# Altium project MiCom.PrjPcb (part 3 of 6)

## Sheet CAN.SchDoc
size A4
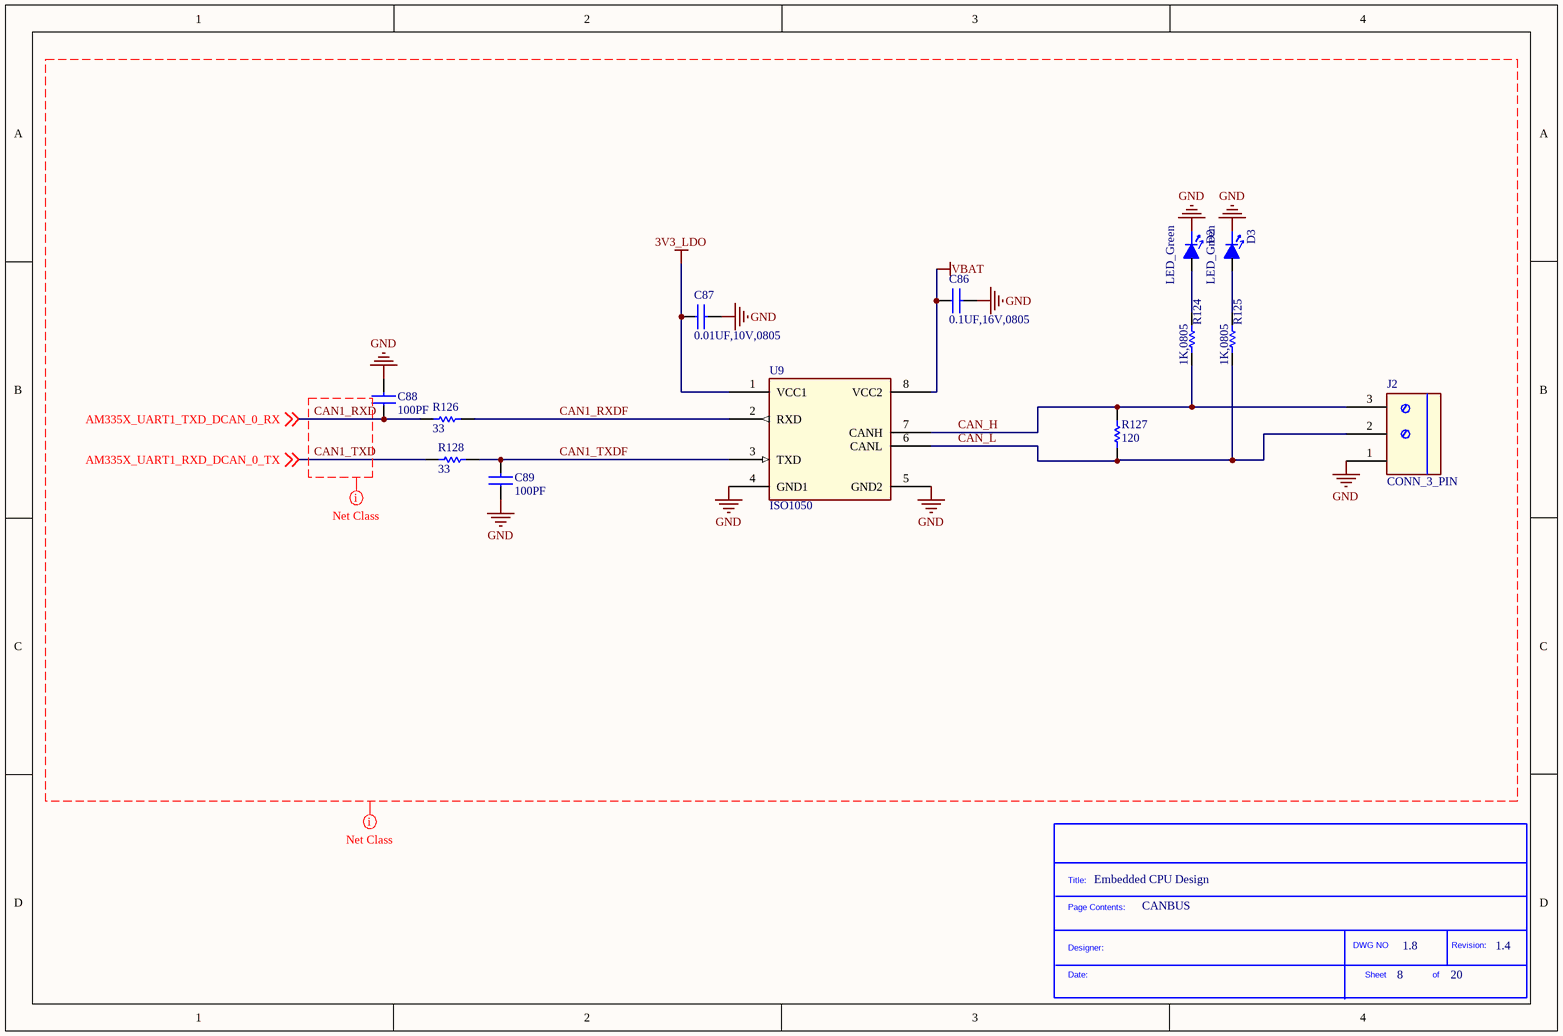
[diagram p8: CAN.SchDoc]

### Parts
(Parts that share a designator on the sheet are numbered #1, #2 ... from top to bottom, then left to right.)
*?#5  SDTitleBlock  (value not drawn)  (graphical)
C86  0.1UF,16V,0805  [0805]
C87  0.01UF,10V,0805  [0805]
C88  100PF  [0805]
C89  100PF  [0805]
D2  LED_Green  [LED_0805]
D3  LED_Green  [LED_0805]
J2  CONN_3_PIN  [CON_3]
R124  1K,0805  [0805]
R125  1K,0805  [0805]
R126  33  [0402]
R127  120  [0805]
R128  33  [0402]
U9  ISO1050  [so8_w_dub]

### Nets
3V3_LDO: C87.1 U9.1(VCC1)
GND: C86.2 C87.2 C88.2 C89.1 D2.1(Cathode) D3.1(Cathode) J2.1 U9.4(GND1) U9.5(GND2)
VBAT: C86.1 U9.8(VCC2)
CAN1_RXD: C88.1 R126.1 ; off-sheet AM335X_UART1_TXD_DCAN_0_RX  [also labelled AM335X_UART1_TXD_DCAN_0_RX]
CAN1_RXDF: R126.2 U9.2(RXD)
CAN1_TXD: R128.1 ; off-sheet AM335X_UART1_RXD_DCAN_0_TX  [also labelled AM335X_UART1_RXD_DCAN_0_TX]
CAN1_TXDF: C89.2 R128.2 U9.3(TXD)
CAN_H: J2.3 R124.1 R127.2 U9.7(CANH)
CAN_L: J2.2 R125.1 R127.1 U9.6(CANL)
NetD2_2: D2.2(Anode) R124.2
NetD3_2: D3.2(Anode) R125.2

### Layout directives
net class CAN: 3V3_LDO, AM335X_UART1_RXD_DCAN_0_TX, AM335X_UART1_TXD_DCAN_0_RX, CAN1_RXD, CAN1_RXDF, CAN1_TXD, CAN1_TXDF, CAN_H, CAN_L, GND, VBAT

### Notes on the sheet
- Embedded CPU Design
- CANBUS
- 8
- 1.8
- 20
- 1.4
- (in symbol SDTitleBlock) Title:; Page Contents:; DWG NO; Revision:; Designer:; Date:; Sheet; of

### Library data of the parts
C86 = 0.1UF,16V,0805: AVX - 0805YC104KAT2A - CAP, MLCC, X7R, 100NF, 16V, 0805; Capacitance: 0.1; Capacitance Tolerance: ± 10%; Dielectric Characteristic: X7; Voltage Rating: 16; Ceramic Capacitor Case: 0805 [2012 Metric]; SVHC: No SVHC (16-Jun-2014); Capacitor Case Style: 0805 [2012 Metric]<!--FANDB--><div class="features-and-benefits-container"></div>; Tolerance: ±10%; Supplier 1: Digi-Key; Manufacturer: AVX; Manufacturer Part Number: 0805YC104KAT2A; RoHS: YES; Stock 1: 9101; Pricing 1: 1=0.29, 10=0.198, 100=0.1008, 250=0.0816, 500=0.072, 1000=0.0612 (USD); Product Range: -; Operating Temperature Min: -55; Operating Temperature Max: 125; Packaging: Cut Tape; MSL: MSL 1 - Unlimited; Capacitance Tolerance ±: ± 10%; ComponentLink1URL: http://www.farnell.com/datasheets/1679506.pdf; ComponentLink1Description: http://www.farnell.com/datasheets/1679506.pdf; Supplier Part Number 1: 478-7961-1-ND; Category: Capacitors; Voltage - Rated: 16V; Temperature Coefficient: X7R; Mounting Type: Surface Mount, MLCC; Operating Temperature: -55°C ~ 125°C; Applications: General Purpose; Ratings: -; Package / Case: 0805 (2012 Metric); Size / Dimension: 0.079" L x 0.049" W (2.00mm x 1.25mm); Height - Seated (Max): -; Thickness (Max): 0.037" (0.94mm); Lead Spacing: -; Features: -; Lead Style: -; ComponentLink2URL: http://www.avx.com/docs/Catalogs/cx7r.pdf; ComponentLink2Description: http://www.avx.com/docs/Catalogs/cx7r.pdf
C87 = 0.01UF,10V,0805: MULTICOMP - MCSH21B103K100CT - CAP, MLCC, X7R, 10NF, 10V, 0805; Capacitance: 10000pF; Tolerance: ±10%; Voltage - Rated: 16V; Supplier 1: Digi-Key; Manufacturer: MULTICOMP; Manufacturer Part Number: MCSH21B103K100CT; RoHS: YES; Stock 1: 21284; Pricing 1: 1=0.24, 10=0.2, 50=0.1126, 100=0.1, 250=0.075, 500=0.06626, 1000=0.05875 (USD); ComponentLink1URL: http://www.farnell.com/datasheets/1825494.pdf; ComponentLink1Description: http://www.farnell.com/datasheets/1825494.pdf; Supplier Part Number 1: 399-7995-1-ND; Category: Capacitors; Packaging: Cut Tape (CT); Temperature Coefficient: X7R; Mounting Type: Surface Mount, MLCC; Operating Temperature: -55°C ~ 125°C; Applications: General Purpose; Ratings: -; Package / Case: 0805 (2012 Metric); Size / Dimension: 0.079" L x 0.049" W (2.00mm x 1.25mm); Height - Seated (Max): -; Thickness (Max): 0.035" (0.88mm); Lead Spacing: -; Features: -; Lead Style: -; ComponentLink2URL: http://www.kemet.com/docfinder?Partnumber=C0805C103K4RACTU; ComponentLink2Description: http://www.kemet.com/docfinder?Partnumber=C0805C103K4RACTU
C88 C89 = 100PF: MULTICOMP - MCMT21N101F100CT - CAP, MLCC, C0G/NP0, 100PF, 10V, 0805; Product Range: MULTICOMP - MCCA Series; Capacitance: 100; Capacitance Tolerance: ± 1%; Voltage Rating: 10; Ceramic Capacitor Case: 0805 [2012 Metric]; Capacitor Terminals: SMD; Temperature Coefficient: ± 30; Tolerance: ±10%; Voltage - Rated: 25V; Supplier 1: Digi-Key; Manufacturer: MULTICOMP; Manufacturer Part Number: MCMT21N101F100CT; RoHS: YES; Stock 1: 10259; Pricing 1: 1=0.16, 10=0.111, 50=0.063, 100=0.0522, 250=0.0432, 500=0.0366, 1000=0.0303 (USD); Dielectric Characteristic: C0G / NP0; Operating Temperature Min: -55; Operating Temperature Max: 125; Packaging: Cut Tape; MSL: -; Capacitance Tolerance ±: ± 1%; Capacitor Case Style: 0805 [2012 Metric]; Operating Temperature Range: -55°C to +125; Series: MT; ComponentLink1URL: http://www.farnell.com/datasheets/876497.pdf; ComponentLink1Description: http://www.farnell.com/datasheets/876497.pdf; ComponentLink2URL: http://www.farnell.com/datasheets/1825496.pdf; ComponentLink2Description: http://www.farnell.com/datasheets/1825496.pdf; Supplier Part Number 1: 399-9150-1-ND; Category: Capacitors; Mounting Type: Surface Mount, MLCC; Operating Temperature: -55°C ~ 125°C; Applications: General Purpose; Ratings: -; Package / Case: 0805 (2012 Metric); Size / Dimension: 0.079" L x 0.049" W (2.00mm x 1.25mm); Height - Seated (Max): -; Thickness (Max): 0.035" (0.88mm); Lead Spacing: -; Features: -; Lead Style: -; ComponentLink3URL: http://www.kemet.com/docfinder?Partnumber=C0805C101K3GACTU; ComponentLink3Description: http://www.kemet.com/docfinder?Partnumber=C0805C101K3GACTU
D2 D3 = LED_Green: LED Green SMD 20mA 2V 0805; TIIntPartnumber: 1F0008; MfrNum: 598-8170-107F; Mfr: Dialight; PartName: LEDGreen2x1.5; Cost10K: 0.052; Cost100: 0.081; Vendor: Digikey; Wavelength - Dominant: 566nm; Millicandela Rating: 20mcd; Viewing Angle: 140°; Lens Type: Clear; Lens Style/Size: Rectangle with Flat Top, 1.4mm x 1.25mm; DescriptiveText: LED Green SMD 20mA 2V 0805; Descriptive_Text: LED Green SMD 20mA 2V 0805; Supplier 1: Digi-Key; Manufacturer: Dialight; Manufacturer Part Number: 598-8170-107F; RoHS: RoHS Compliant; Category: Optoelectronics; Stock 1: 91030; Pricing 1: 1=0.42, 10=0.31, 25=0.248, 100=0.1643, 250=0.1364, 500=0.0992, 1000=0.0775 (USD); Packaging: Cut Tape (CT); Color: Green; Wavelength - Peak: -; Voltage - Forward (Vf) (Typ): 2V; Current - Test: 20mA; Package / Case: 0805 (2012 Metric); Size / Dimension: 2.00mm L x 1.25mm W; Height: 0.70mm; Mounting Type: Surface Mount; Luminous Flux @ Current - Test: -; ComponentLink1URL: http://media.digikey.com/pdf/Data%20Sheets/Dialight%20PDFs/598_Series_0805_Pkg.pdf; ComponentLink1Description: http://media.digikey.com/pdf/Data%20Sheets/Dialight%20PDFs/598_Series_0805_Pkg.pdf; Supplier Part Number 1: 350-2044-1-ND
R124 R125 = 1K,0805: BOURNS - CR0805-FX-1001ELF - RESISTOR, 1K, 0.125W, 1%; Product Range: BOURNS - CR Series; Resistance: 1; Power Rating: 125; Resistor Case Style: 0805 [2012 Metric]; Resistor Element Material: Thick Film; Temperature Coefficient: ± 100; Voltage Rating: 150; SVHC: No SVHC (16-Jun-2014); Resistor Mounting: SMD<!--FANDB--><div class="features-and-benefits-container"></div>; Power (Watts): 0.125W, 1/8W; Manufacturer: BOURNS; Manufacturer Part Number: CR0805-FX-1001ELF; RoHS: YES; Resistance Tolerance: ± 1%; Packaging: Cut Tape; MSL: MSL 1 - Unlimited; ComponentLink1URL: http://www.farnell.com/datasheets/1845293.pdf; ComponentLink1Description: http://www.farnell.com/datasheets/1845293.pdf; Supplier 1: Digi-Key; Category: Resistors; Stock 1: 2060902; Pricing 1: 1=0.1, 50=0.0288, 100=0.0219, 250=0.01624, 500=0.012, 1000=0.008, 2500=0.00675 (USD); Resistance (Ohms): 1k; Tolerance: ±1%; Composition: Thick Film; Features: Automotive AEC-Q200; Operating Temperature: -55°C ~ 155°C; Package / Case: 0805 (2012 Metric); Supplier Device Package: 0805; Size / Dimension: 0.079" L x 0.049" W (2.00mm x 1.25mm); Height: 0.028" (0.70mm); Number of Terminations: 2; ComponentLink2URL: http://industrial.panasonic.com/www-cgi/jvcr13pz.cgi?E+PZ+3+AOA0002+ERJ6ENF1001V+7+WW; ComponentLink2Description: http://industrial.panasonic.com/www-cgi/jvcr13pz.cgi?E+PZ+3+AOA0002+ERJ6ENF1001V+7+WW; Supplier Part Number 1: P1.00KCCT-ND
R126 R128 = 33: MULTICOMP - MC0805S8F330JT5E - RESISTOR, THICK FILM, 33 OHM, 125mW, 1%; Power (Watts): 0.1W, 1/10W; Temperature Coefficient: ±100ppm/°C; Supplier 1: Digi-Key; Manufacturer: MULTICOMP; Manufacturer Part Number: MC0805S8F330JT5E; RoHS: YES; Stock 1: 1096583; Pricing 1: 1=0.1, 50=0.0196, 100=0.0149, 250=0.01104, 500=0.00816, 1000=0.00544, 5000=0.00383 (USD); ComponentLink1URL: http://www.newark.com/pdfs/datasheets/spc/TA-677.pdf; ComponentLink1Description: http://www.newark.com/pdfs/datasheets/spc/TA-677.pdf; Supplier Part Number 1: P33.0LCT-ND; Category: Resistors; Packaging: Cut Tape (CT); Resistance (Ohms): 33; Tolerance: ±1%; Composition: Thick Film; Features: Automotive AEC-Q200; Operating Temperature: -55°C ~ 155°C; Package / Case: 0402 (1005 Metric); Supplier Device Package: 0402; Size / Dimension: 0.039" L x 0.020" W (1.00mm x 0.50mm); Height: 0.016" (0.40mm); Number of Terminations: 2; ComponentLink2URL: http://industrial.panasonic.com/www-cgi/jvcr13pz.cgi?E+PZ+3+AOA0002+ERJ2RKF33R0X+7+WW; ComponentLink2Description: http://industrial.panasonic.com/www-cgi/jvcr13pz.cgi?E+PZ+3+AOA0002+ERJ2RKF33R0X+7+WW
R127 = 120: BOURNS - CR0805-FX-1200GLF - RESISTOR, 0805, 120R, 1%, 1/8W; Tolerance: ±5%; Power (Watts): 0.125W, 1/8W; Temperature Coefficient: ±200ppm/°C; Supplier 1: Digi-Key; Manufacturer: BOURNS; Manufacturer Part Number: CR0805-FX-1200GLF; RoHS: YES; Stock 1: 49631; Pricing 1: 1=0.1, 10=0.021, 50=0.0116, 100=0.0088, 250=0.00652, 500=0.0048, 1000=0.0032, 2500=0.0027 (USD); ComponentLink1URL: http://www.farnell.com/datasheets/1845293.pdf; ComponentLink1Description: http://www.farnell.com/datasheets/1845293.pdf; Supplier Part Number 1: RMCF0805JT120RCT-ND; Category: Resistors; Packaging: Cut Tape (CT); Resistance (Ohms): 120; Composition: Thick Film; Features: -; Operating Temperature: -55°C ~ 155°C; Package / Case: 0805 (2012 Metric); Supplier Device Package: 0805; Size / Dimension: 0.079" L x 0.049" W (2.00mm x 1.25mm); Height: 0.026" (0.65mm); Number of Terminations: 2; ComponentLink2URL: http://www.seielect.com/Catalog/SEI-RMCF_RMCP.pdf; ComponentLink2Description: http://www.seielect.com/Catalog/SEI-RMCF_RMCP.pdf
U9 = ISO1050: Isolated CAN Transceiver; TIIntPartnumber: 1A0214; MfrNum: ISO1050DUB; Mfr: TI; Manufacturer: Texas Instruments; Cost10K: 1.91; Cost100: 3.41; Vendor: Digikey; Number of Drivers/Receivers: 1/1; Duplex: Half; Receiver Hysteresis: 150mV; Data Rate: 1Mbps; Voltage - Supply: 3 V ~ 5.5 V; Descriptive_Text: Isolated CAN Transceiver; PartName: ISO1050; DescriptiveText: Isolated CAN Transceiver; Supplier 1: Digi-Key; Supplier Part Number 1: 296-33295-5-ND; Manufacturer Part Number: ISO1050DUB; RoHS: RoHS Compliant; Category: Integrated Circuits (ICs); Stock 1: 3315; Pricing 1: 1=5.8, 10=5.175, 25=4.6576, 100=4.2435, 250=3.82952, 500=3.4362, 750=3.105, 1000=2.5875 (USD); Packaging: Tube; Type: Transceiver; Protocol: CAN; Operating Temperature: -55°C ~ 105°C; Mounting Type: Surface Mount; Package / Case: 8-SMD, Gull Wing; Supplier Device Package: 8-SOP; ComponentLink1URL: http://www.ti.com/lit/ds/symlink/iso1050.pdf; ComponentLink1Description: http://www.ti.com/lit/ds/symlink/iso1050.pdf

## Sheet DDR_3.SchDoc
size A2
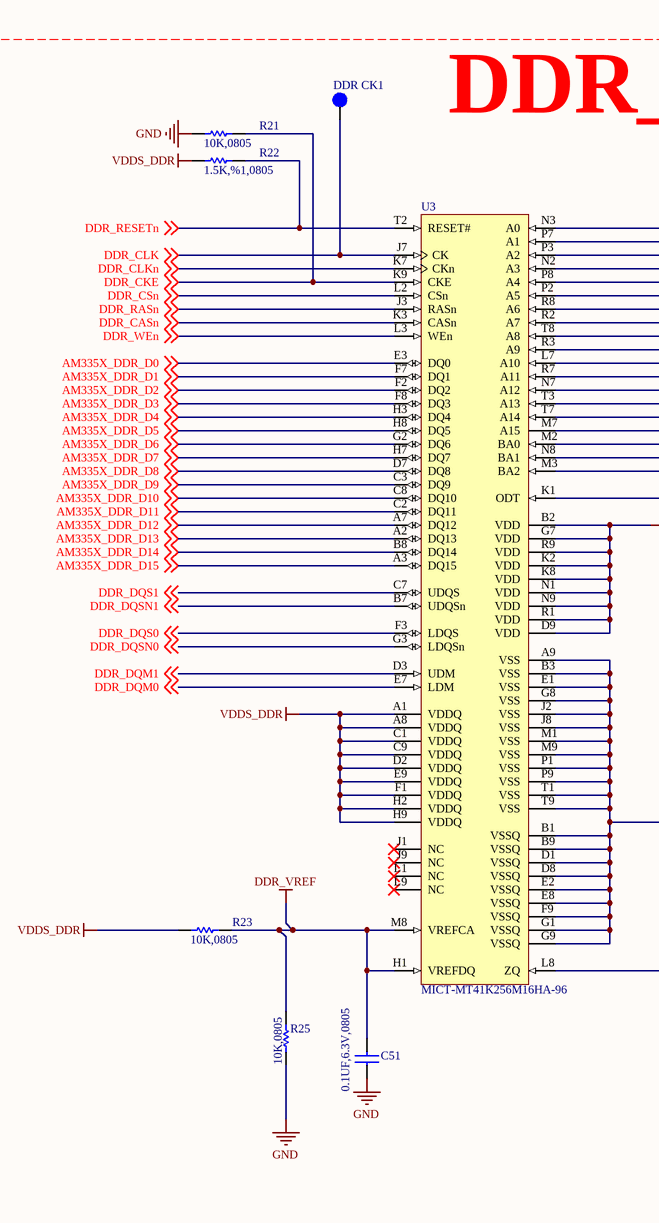
[diagram p9: DDR_3.SchDoc, left]
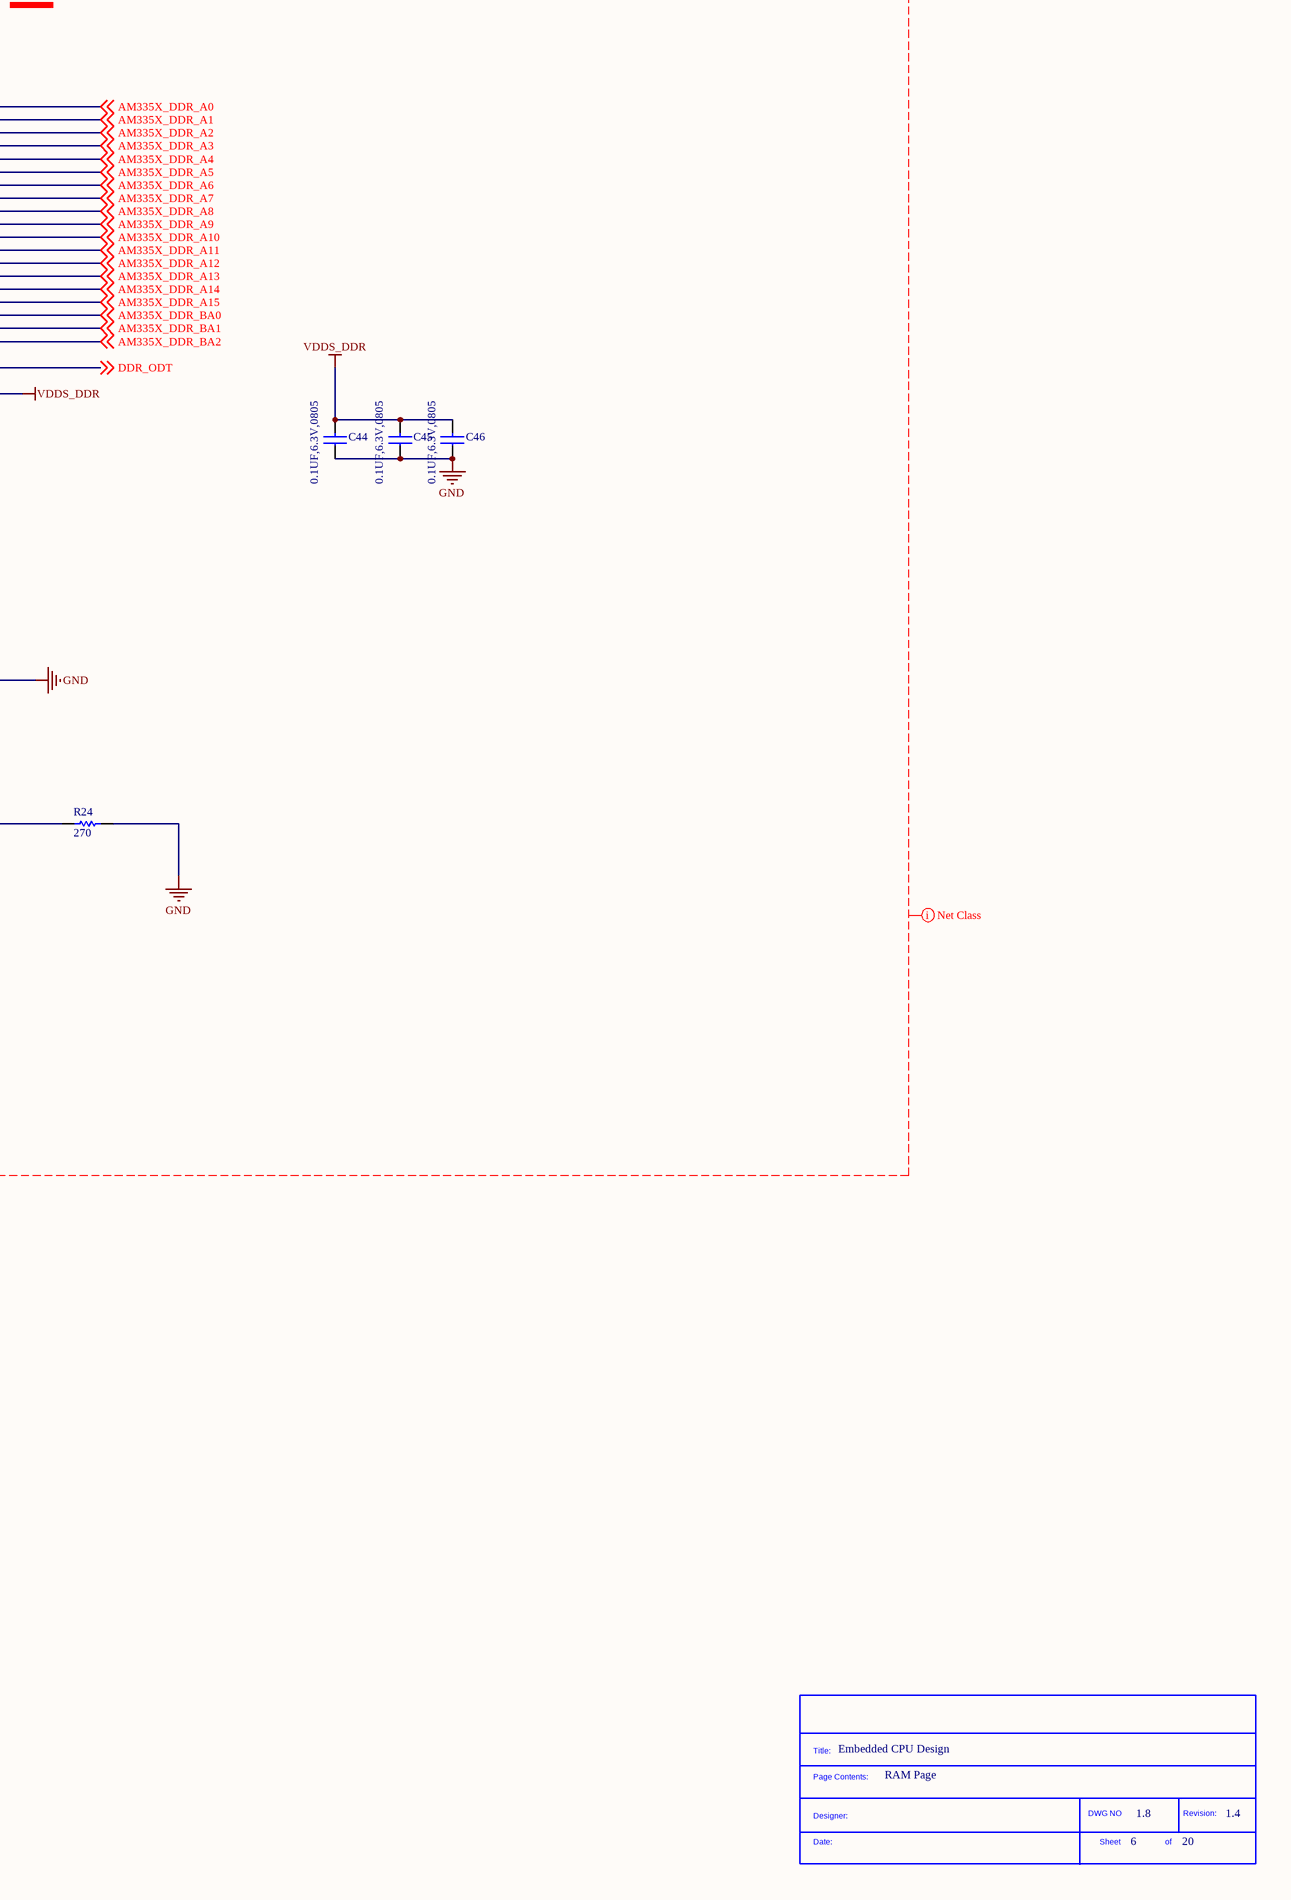
[diagram p10: DDR_3.SchDoc, right]

### Parts
(Parts that share a designator on the sheet are numbered #1, #2 ... from top to bottom, then left to right.)
*?#6  SDTitleBlock  (value not drawn)  (graphical)
C44  0.1UF,6.3V,0805  [0402]
C45  0.1UF,6.3V,0805  [0402]
C46  0.1UF,6.3V,0805  [0402]
C51  0.1UF,6.3V,0805  [0402]
DDR_CK1  Testpoint  [tp_smd1mmcircle]  (value not drawn)
R21  10K,0805  [0402]
R22  1.5K,%1,0805  [0402]
R23  10K,0805  [0402]
R24  270  [0402]
R25  10K,0805  [0402]
U3  MICT-MT41K256M16HA-96  [MICT-HA-96]

### Nets
DDR_VREF: C51.2 R23.2 R25.2 U3.H1(VREFDQ) U3.M8(VREFCA)  [project net VREF_AM_DR]
GND: C44.1 C45.1 C46.1 C51.1 R21.1 R24.2 R25.1 U3.A9(VSS) U3.B1(VSSQ) U3.B3(VSS) U3.B9(VSSQ) U3.D1(VSSQ) U3.D8(VSSQ) U3.E1(VSS) U3.E2(VSSQ) U3.E8(VSSQ) U3.F9(VSSQ) U3.G1(VSSQ) U3.G8(VSS) U3.G9(VSSQ) U3.J2(VSS) U3.J8(VSS) U3.M1(VSS) U3.M9(VSS) U3.P1(VSS) U3.P9(VSS) U3.T1(VSS) U3.T9(VSS)
VDDS_DDR: C44.2 C45.2 C46.2 R22.2 R23.1 U3.A1(VDDQ) U3.A8(VDDQ) U3.B2(VDD) U3.C1(VDDQ) U3.C9(VDDQ) U3.D2(VDDQ) U3.D9(VDD) U3.E9(VDDQ) U3.F1(VDDQ) U3.G7(VDD) U3.H2(VDDQ) U3.H9(VDDQ) U3.K2(VDD) U3.K8(VDD) U3.N1(VDD) U3.N9(VDD) U3.R1(VDD) U3.R9(VDD)  [project net PM_VDDS_DDR]
AM335X_DDR_A0: U3.N3(A0) ; off-sheet AM335X_DDR_A0  [project net DDR_A_0]
AM335X_DDR_A1: U3.P7(A1) ; off-sheet AM335X_DDR_A1  [project net DDR_A_1]
AM335X_DDR_A2: U3.P3(A2) ; off-sheet AM335X_DDR_A2  [project net DDR_A_2]
AM335X_DDR_A3: U3.N2(A3) ; off-sheet AM335X_DDR_A3  [project net DDR_A_3]
AM335X_DDR_A4: U3.P8(A4) ; off-sheet AM335X_DDR_A4  [project net DDR_A_4]
AM335X_DDR_A5: U3.P2(A5) ; off-sheet AM335X_DDR_A5  [project net DDR_A_5]
AM335X_DDR_A6: U3.R8(A6) ; off-sheet AM335X_DDR_A6  [project net DDR_A_6]
AM335X_DDR_A7: U3.R2(A7) ; off-sheet AM335X_DDR_A7  [project net DDR_A_7]
AM335X_DDR_A8: U3.T8(A8) ; off-sheet AM335X_DDR_A8  [project net DDR_A_8]
AM335X_DDR_A9: U3.R3(A9) ; off-sheet AM335X_DDR_A9  [project net DDR_A_9]
AM335X_DDR_A10: U3.L7(A10) ; off-sheet AM335X_DDR_A10  [project net DDR_A_10]
AM335X_DDR_A11: U3.R7(A11) ; off-sheet AM335X_DDR_A11  [project net DDR_A_11]
AM335X_DDR_A12: U3.N7(A12) ; off-sheet AM335X_DDR_A12  [project net DDR_A_12]
AM335X_DDR_A13: U3.T3(A13) ; off-sheet AM335X_DDR_A13  [project net DDR_A_13]
AM335X_DDR_A14: U3.T7(A14) ; off-sheet AM335X_DDR_A14  [project net DDR_A_14]
AM335X_DDR_A15: U3.M7(A15) ; off-sheet AM335X_DDR_A15  [project net DDR_A_15]
AM335X_DDR_BA0: U3.M2(BA0) ; off-sheet AM335X_DDR_BA0  [project net DDR_BA_0]
AM335X_DDR_BA1: U3.N8(BA1) ; off-sheet AM335X_DDR_BA1  [project net DDR_BA_1]
AM335X_DDR_BA2: U3.M3(BA2) ; off-sheet AM335X_DDR_BA2  [project net DDR_BA_2]
AM335X_DDR_D0: U3.E3(DQ0) ; off-sheet AM335X_DDR_D0  [project net DDR_D_0]
AM335X_DDR_D1: U3.F7(DQ1) ; off-sheet AM335X_DDR_D1  [project net DDR_D_1]
AM335X_DDR_D2: U3.F2(DQ2) ; off-sheet AM335X_DDR_D2  [project net DDR_D_2]
AM335X_DDR_D3: U3.F8(DQ3) ; off-sheet AM335X_DDR_D3  [project net DDR_D_3]
AM335X_DDR_D4: U3.H3(DQ4) ; off-sheet AM335X_DDR_D4  [project net DDR_D_4]
AM335X_DDR_D5: U3.H8(DQ5) ; off-sheet AM335X_DDR_D5  [project net DDR_D_5]
AM335X_DDR_D6: U3.G2(DQ6) ; off-sheet AM335X_DDR_D6  [project net DDR_D_6]
AM335X_DDR_D7: U3.H7(DQ7) ; off-sheet AM335X_DDR_D7  [project net DDR_D_7]
AM335X_DDR_D8: U3.D7(DQ8) ; off-sheet AM335X_DDR_D8  [project net DDR_D_8]
AM335X_DDR_D9: U3.C3(DQ9) ; off-sheet AM335X_DDR_D9  [project net DDR_D_9]
AM335X_DDR_D10: U3.C8(DQ10) ; off-sheet AM335X_DDR_D10  [project net DDR_D_10]
AM335X_DDR_D11: U3.C2(DQ11) ; off-sheet AM335X_DDR_D11  [project net DDR_D_11]
AM335X_DDR_D12: U3.A7(DQ12) ; off-sheet AM335X_DDR_D12  [project net DDR_D_12]
AM335X_DDR_D13: U3.A2(DQ13) ; off-sheet AM335X_DDR_D13  [project net DDR_D_13]
AM335X_DDR_D14: U3.B8(DQ14) ; off-sheet AM335X_DDR_D14  [project net DDR_D_14]
AM335X_DDR_D15: U3.A3(DQ15) ; off-sheet AM335X_DDR_D15  [project net DDR_D_15]
DDR_CASn: U3.K3(CASn) ; off-sheet DDR_CASn  [project net DDR_D_CASn]
DDR_CKE: R21.2 U3.K9(CKE) ; off-sheet DDR_CKE  [project net DDR_D_CKE]
DDR_CLK: DDR_CK1.1 U3.J7(CK) ; off-sheet DDR_CLK  [project net DDR_D_CLK]
DDR_CLKn: U3.K7(CKn) ; off-sheet DDR_CLKn  [project net DDR_D_CLKn]
DDR_CSn: U3.L2(CSn) ; off-sheet DDR_CSn  [project net DDR_D_CSn]
DDR_DQM0: U3.E7(LDM) ; off-sheet DDR_DQM0  [project net DDR_D_DQM0]
DDR_DQM1: U3.D3(UDM) ; off-sheet DDR_DQM1  [project net DDR_D_DQM1]
DDR_DQS0: U3.F3(LDQS) ; off-sheet DDR_DQS0  [project net DDR_D_DQS0]
DDR_DQS1: U3.C7(UDQS) ; off-sheet DDR_DQS1  [project net DDR_D_DQS1]
DDR_DQSN0: U3.G3(LDQSn) ; off-sheet DDR_DQSN0  [project net DDR_D_DQSN0]
DDR_DQSN1: U3.B7(UDQSn) ; off-sheet DDR_DQSN1  [project net DDR_D_DQSN1]
DDR_ODT: U3.K1(ODT) ; off-sheet DDR_ODT  [project net DDR_D_ODT]
DDR_RASn: U3.J3(RASn) ; off-sheet DDR_RASn  [project net DDR_D_RASn]
DDR_RESETN: R22.1 U3.T2(RESET#) ; off-sheet DDR_RESETn
DDR_WEn: U3.L3(WEn) ; off-sheet DDR_WEn  [project net DDR_D_WEn]
NetR24_1: R24.1 U3.L8(ZQ)

Not connected (* = marked no-connect by the designer): U3 J1(NC)* J9(NC)* L1(NC)* L9(NC)*

### Layout directives
net class DDR_3: AM335X_DDR_A0, AM335X_DDR_A1, AM335X_DDR_A2, AM335X_DDR_A3, AM335X_DDR_A4, AM335X_DDR_A5, AM335X_DDR_A6, AM335X_DDR_A7, AM335X_DDR_A8, AM335X_DDR_A9, AM335X_DDR_A10, AM335X_DDR_A11, AM335X_DDR_A12, AM335X_DDR_A13, AM335X_DDR_A14, AM335X_DDR_A15, AM335X_DDR_BA0, AM335X_DDR_BA1, AM335X_DDR_BA2, AM335X_DDR_D0, AM335X_DDR_D1, AM335X_DDR_D2, AM335X_DDR_D3, AM335X_DDR_D4, AM335X_DDR_D5, AM335X_DDR_D6, AM335X_DDR_D7, AM335X_DDR_D8, AM335X_DDR_D9, AM335X_DDR_D10, AM335X_DDR_D11, AM335X_DDR_D12, AM335X_DDR_D13, AM335X_DDR_D14, AM335X_DDR_D15, DDR_CASn, DDR_CKE, DDR_CLK, DDR_CLKn, DDR_CSn, DDR_DQM0, DDR_DQM1, DDR_DQS0, DDR_DQS1, DDR_DQSN0, DDR_DQSN1, DDR_ODT, DDR_RASn, DDR_RESETn, DDR_VREF, DDR_WEn, GND, VDDS_DDR

### Notes on the sheet
- DDR_3
- Embedded CPU Design
- RAM Page
- 6
- 1.8
- 20
- 1.4
- (in symbol SDTitleBlock) Title:; Page Contents:; Designer:; DWG NO; Revision:; Date:; Sheet; of

### Library data of the parts
C44-C46 C51 = 0.1UF,6.3V,0805: CAP CER 0.1UF 6.3V 10% X7R 0805; Manufacturer: Kemet; Manufacturer Part Number: C0805C104K9RACTU; Capacitance: 0.1µF; Supplier 1: Digi-Key; RoHS: RoHS Compliant; Category: Capacitors; Stock 1: 19204; Pricing 1: 1=0.12, 10=0.083, 25=0.062, 50=0.0476, 100=0.0392, 250=0.03304, 1000=0.02228 (USD); Packaging: Digi-Reel®; Tolerance: ±10%; Voltage - Rated: 6.3V; Temperature Coefficient: X7R; Mounting Type: Surface Mount, MLCC; Operating Temperature: -55°C ~ 125°C; Applications: General Purpose; Ratings: -; Package / Case: 0805 (2012 Metric); Size / Dimension: 0.079" L x 0.049" W (2.00mm x 1.25mm); Height - Seated (Max): -; Thickness (Max): 0.035" (0.88mm); Lead Spacing: -; Features: -; Lead Style: -; ComponentLink1URL: http://www.kemet.com/docfinder?Partnumber=C0805C104K9RACTU; ComponentLink1Description: http://www.kemet.com/docfinder?Partnumber=C0805C104K9RACTU; Supplier Part Number 1: 399-9155-6-ND
DDR_CK1 = Testpoint_SMD1mmCircle: Testpoint SMD; PartName: TestpointSMD1mmCircle; TIIntPartnumber: 2H0046; DescriptiveText: Testpoint SMD 1mm circle pad; Cost100: 0; Mfr: N/A; MfrNum: N/A; Vendor: N/A; Cost10K: 0; Descriptive_Text: Testpoint SMD 1mm circle pad
R21 R23 R25 = 10K,0805: BOURNS - CR0805-FX-1002GLF - RESISTOR, 10K, 0.125W, 1%; Product Range: BOURNS - CR Series; Resistance: 10; Power Rating: 125; Resistor Case Style: 0805 [2012 Metric]; Resistor Element Material: Thick Film; Temperature Coefficient: ± 100; Voltage Rating: 150; SVHC: No SVHC (16-Jun-2014); Resistor Mounting: SMD<!--FANDB--><div class="features-and-benefits-container"></div>; Power (Watts): 0.125W, 1/8W; Manufacturer: BOURNS; Manufacturer Part Number: CR0805-FX-1002GLF; RoHS: YES; Resistance Tolerance: ± 1%; Packaging: Cut Tape; MSL: MSL 1 - Unlimited; ComponentLink1URL: http://www.farnell.com/datasheets/1845293.pdf; ComponentLink1Description: http://www.farnell.com/datasheets/1845293.pdf; Supplier 1: Digi-Key; Category: Resistors; Stock 1: 1116166; Pricing 1: 1=0.1, 10=0.029, 50=0.0162, 100=0.0123, 250=0.00912, 500=0.00672, 1000=0.00448, 2500=0.00378 (USD); Resistance (Ohms): 10k; Tolerance: ±1%; Composition: Thick Film; Features: -; Operating Temperature: -55°C ~ 155°C; Package / Case: 0805 (2012 Metric); Supplier Device Package: 0805; Size / Dimension: 0.079" L x 0.049" W (2.00mm x 1.25mm); Height: 0.026" (0.65mm); Number of Terminations: 2; ComponentLink2URL: http://www.seielect.com/Catalog/SEI-RMCF_RMCP.pdf; ComponentLink2Description: http://www.seielect.com/Catalog/SEI-RMCF_RMCP.pdf; Supplier Part Number 1: RMCF0805FT10K0CT-ND
R22 = 1.5K,%1,0805: MULTICOMP - MCPWR05FTEW1501 - RESISTOR, 0805, 1.5K 1%,  0.125W; Product Range: MULTICOMP - MCPWR Series; Resistance: 1.5; Power Rating: 125; Resistor Case Style: 0805 [2012 Metric]; Resistor Element Material: Thick Film; Temperature Coefficient: ± 100; Voltage Rating: 150; SVHC: No SVHC (16-Jun-2014); Resistor Mounting: SMD<!--FANDB--><div class="features-and-benefits-container"></div>; Power (Watts): 0.125W, 1/8W; Manufacturer: MULTICOMP; Manufacturer Part Number: MCPWR05FTEW1501; RoHS: Y-EX; Resistance Tolerance: ± 1%; Packaging: Cut Tape; MSL: -; ComponentLink1URL: http://www.farnell.com/datasheets/1718729.pdf; ComponentLink1Description: http://www.farnell.com/datasheets/1718729.pdf; ComponentLink2URL: http://www.farnell.com/cad/1638340.zip; ComponentLink2Description: http://www.farnell.com/cad/1638340.zip; Supplier 1: Digi-Key; Category: Resistors; Stock 1: 277366; Pricing 1: 1=0.1, 50=0.0288, 100=0.0219, 250=0.01624, 500=0.012, 1000=0.008, 2500=0.00675 (USD); Resistance (Ohms): 1.5k; Tolerance: ±1%; Composition: Thick Film; Features: Automotive AEC-Q200; Operating Temperature: -55°C ~ 155°C; Package / Case: 0805 (2012 Metric); Supplier Device Package: 0805; Size / Dimension: 0.079" L x 0.049" W (2.00mm x 1.25mm); Height: 0.028" (0.70mm); Number of Terminations: 2; ComponentLink3URL: http://industrial.panasonic.com/www-cgi/jvcr13pz.cgi?E+PZ+3+AOA0002+ERJ6ENF1501V+7+WW; ComponentLink3Description: http://industrial.panasonic.com/www-cgi/jvcr13pz.cgi?E+PZ+3+AOA0002+ERJ6ENF1501V+7+WW; Supplier Part Number 1: P1.50KCCT-ND
R24 = 1K,0805: as R124 on sheet CAN; Manufacturer: BOURNS; Manufacturer Part Number: CR0805-FX-1001ELF; RoHS: YES; Resistance Tolerance: ± 1%; Packaging: Cut Tape; MSL: MSL 1 - Unlimited; ComponentLink1URL: http://www.farnell.com/datasheets/1845293.pdf; ComponentLink1Description: http://www.farnell.com/datasheets/1845293.pdf; Supplier 1: Digi-Key; Category: Resistors; Stock 1: 2060902; Pricing 1: 1=0.1, 50=0.0288, 100=0.0219, 250=0.01624, 500=0.012, 1000=0.008, 2500=0.00675 (USD); Resistance (Ohms): 1k; Tolerance: ±1%; Composition: Thick Film; Features: Automotive AEC-Q200; Operating Temperature: -55°C ~ 155°C; Package / Case: 0805 (2012 Metric); Supplier Device Package: 0805; Size / Dimension: 0.079" L x 0.049" W (2.00mm x 1.25mm); Height: 0.028" (0.70mm); Number of Terminations: 2; ComponentLink2URL: http://industrial.panasonic.com/www-cgi/jvcr13pz.cgi?E+PZ+3+AOA0002+ERJ6ENF1001V+7+WW; ComponentLink2Description: http://industrial.panasonic.com/www-cgi/jvcr13pz.cgi?E+PZ+3+AOA0002+ERJ6ENF1001V+7+WW; Supplier Part Number 1: P1.00KCCT-ND

## Sheet ETHERNET.SchDoc
size A2
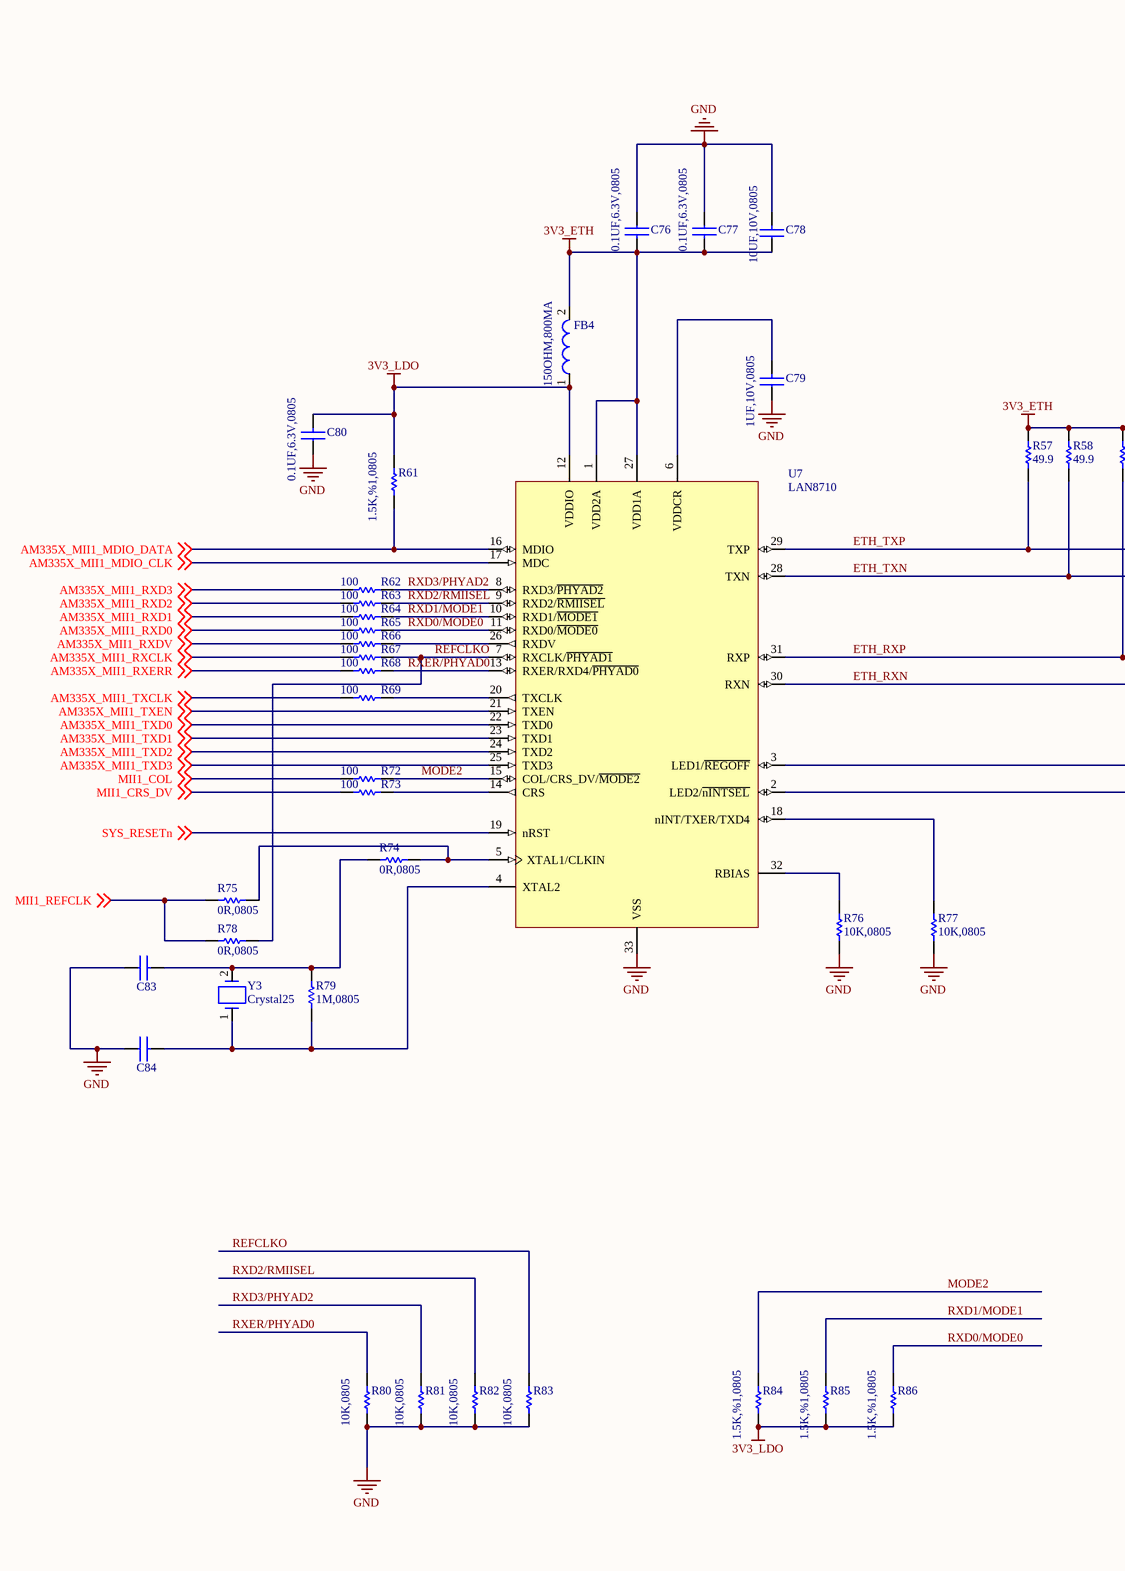
[diagram p11: ETHERNET.SchDoc, left]
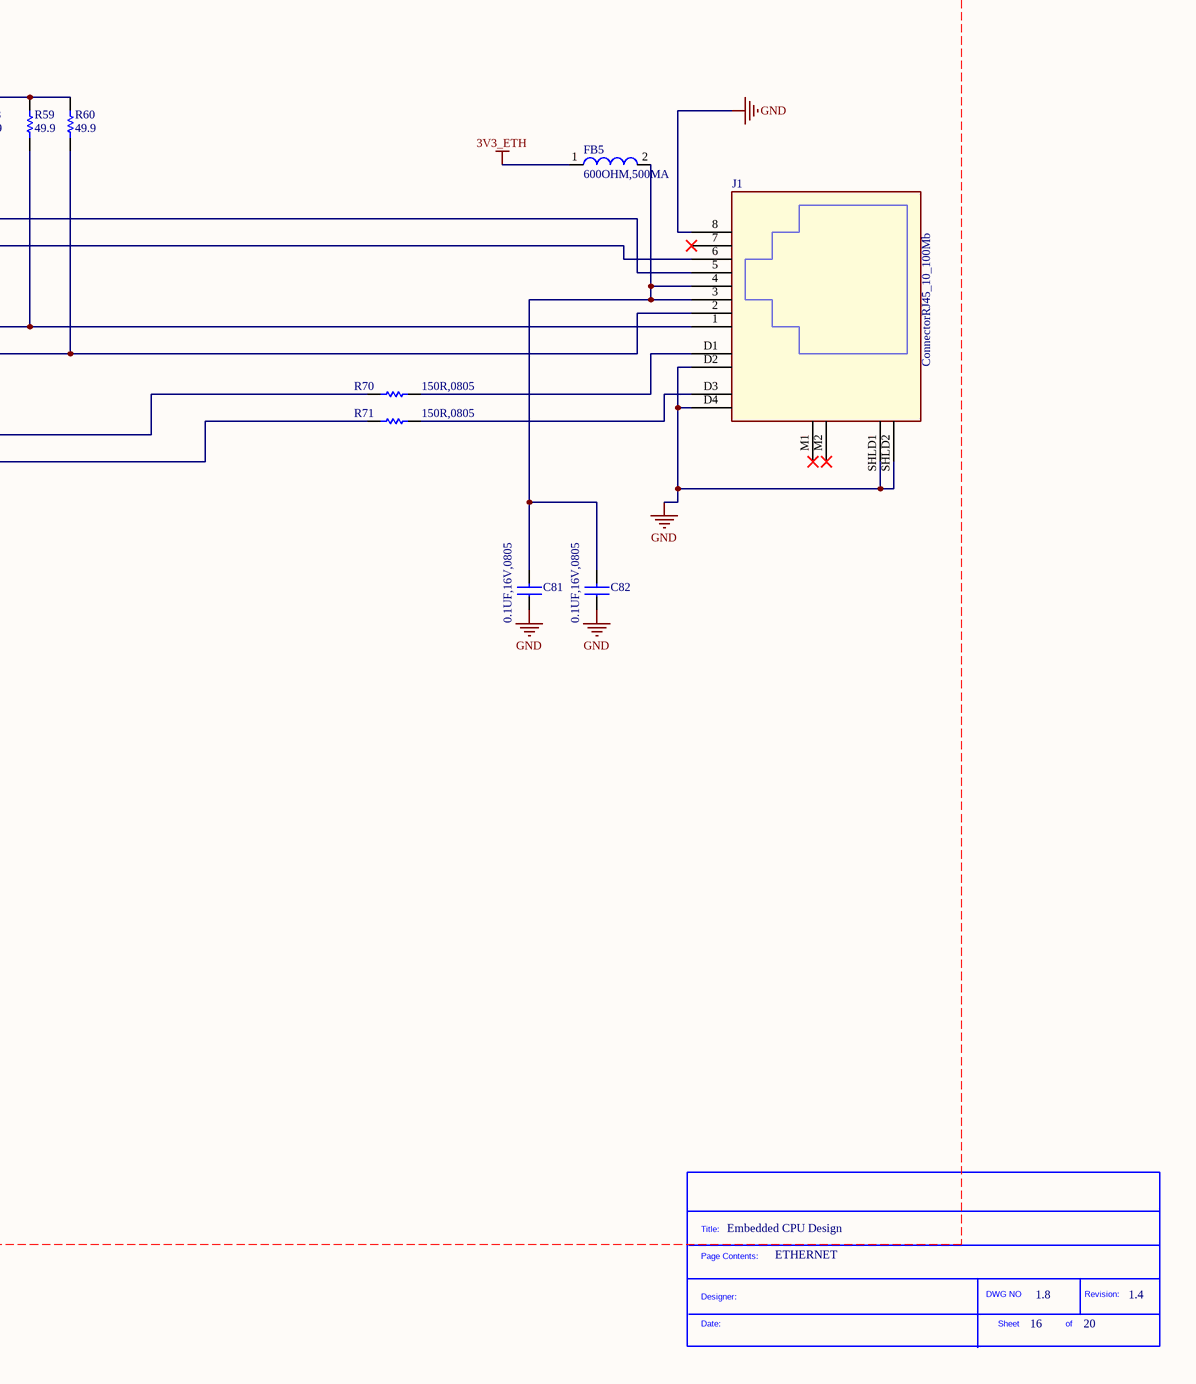
[diagram p12: ETHERNET.SchDoc, right]

### Parts
(Parts that share a designator on the sheet are numbered #1, #2 ... from top to bottom, then left to right.)
*?#7  SDTitleBlock  (value not drawn)  (graphical)
C76  0.1UF,6.3V,0805  [0805]
C77  0.1UF,6.3V,0805  [0805]
C78  10UF,10V,0805  [0805]
C79  1UF,10V,0805  [0805]
C80  0.1UF,6.3V,0805  [0805]
C81  0.1UF,16V,0805  [0805]
C82  0.1UF,16V,0805  [0805]
C83  18PF,50V,0805  [0805]  (value not drawn)
C84  18PF,50V,0805  [0805]  (value not drawn)
FB4  150OHM,800MA  [0805]
FB5  600OHM,500MA  [0805]
J1  ConnectorRJ45_10_100Mb  [6605728-1]
R57  49.9  [0402]
R58  49.9  [0402]
R59  49.9  [0402]
R60  49.9  [0402]
R61  1.5K,%1,0805  [0805]
R62  100  [0805]
R63  100  [0805]
R64  100  [0805]
R65  100  [0805]
R66  100  [0805]
R67  100  [0805]
R68  100  [0805]
R69  100  [0805]
R70  150R,0805  [0805]
R71  150R,0805  [0805]
R72  100  [0805]
R73  100  [0805]
R74  0R,0805  [0805]
R75  0R,0805  [0805]
R76  10K,0805  [0805]
R77  10K,0805  [0805]
R78  0R,0805  [0805]
R79  1M,0805  [0805]
R80  10K,0805  [0805]
R81  10K,0805  [0805]
R82  10K,0805  [0805]
R83  10K,0805  [0805]
R84  1.5K,%1,0805  [0805]
R85  1.5K,%1,0805  [0805]
R86  1.5K,%1,0805  [0805]
U7  LAN8710  [MCHP-QFN-32-5x5_V1]
Y3  Crystal25  [SM_OSC_ABM3]

### Nets
3V3_ETH: C76.2 C77.2 C78.1 FB4.2 FB5.1 R57.2 R58.2 R59.2 R60.2 U7.1(VDD2A) U7.27(VDD1A)
3V3_LDO: C80.2 FB4.1 R61.2 R84.1 R85.1 R86.1 U7.12(VDDIO)
GND: C76.1 C77.1 C78.2 C79.1 C80.1 C81.1 C82.1 C83.1 C84.1 J1.8 J1.D2 J1.D4 J1.SHLD1 J1.SHLD2 R76.1 R77.1 R80.1 R81.1 R82.1 R83.1 U7.33(VSS)
AM335X_MII1_MDIO_CLK: U7.17(MDC) ; off-sheet AM335X_MII1_MDIO_CLK  [project net MII_17]
AM335X_MII1_MDIO_DATA: R61.1 U7.16(MDIO) ; off-sheet AM335X_MII1_MDIO_DATA  [project net MII_18]
AM335X_MII1_RXCLK: R67.1 ; off-sheet AM335X_MII1_RXCLK  [project net MII_9]
AM335X_MII1_RXD0: R65.1 ; off-sheet AM335X_MII1_RXD0  [project net MII_10]
AM335X_MII1_RXD1: R64.1 ; off-sheet AM335X_MII1_RXD1  [project net MII_11]
AM335X_MII1_RXD2: R63.1 ; off-sheet AM335X_MII1_RXD2  [project net MII_12]
AM335X_MII1_RXD3: R62.1 ; off-sheet AM335X_MII1_RXD3  [project net MII_13]
AM335X_MII1_RXDV: R66.1 ; off-sheet AM335X_MII1_RXDV  [project net MII_15]
AM335X_MII1_RXERR: R68.1 ; off-sheet AM335X_MII1_RXERR  [project net MII_14]
AM335X_MII1_TXCLK: R69.1 ; off-sheet AM335X_MII1_TXCLK  [project net MII_1]
AM335X_MII1_TXD0: U7.22(TXD0) ; off-sheet AM335X_MII1_TXD0  [project net MII_2]
AM335X_MII1_TXD1: U7.23(TXD1) ; off-sheet AM335X_MII1_TXD1  [project net MII_3]
AM335X_MII1_TXD2: U7.24(TXD2) ; off-sheet AM335X_MII1_TXD2  [project net MII_4]
AM335X_MII1_TXD3: U7.25(TXD3) ; off-sheet AM335X_MII1_TXD3  [project net MII_5]
AM335X_MII1_TXEN: U7.21(TXEN) ; off-sheet AM335X_MII1_TXEN  [project net MII_6]
ETH_RXN: J1.2 R60.1 U7.30(RXN)
ETH_RXP: J1.1 R59.1 U7.31(RXP)
ETH_TXN: J1.6 R58.1 U7.28(TXN)
ETH_TXP: J1.5 R57.1 U7.29(TXP)
MII1_COL: R72.1 ; off-sheet MII1_COL  [project net MII_COL]
MII1_CRS_DV: R73.1 ; off-sheet MII1_CRS_DV  [project net MII_CRS]
MII1_REFCLK: R75.1 R78.1 ; off-sheet MII1_REFCLK  [project net MII_REF_CLK]
MODE2: R72.2 R84.2 U7.15(COL/CRS_DV/~{MODE2})
REFCLKO: R67.2 R78.2 R83.2 U7.7(RXCLK/~{PHYAD1})
RXD0/MODE0: R65.2 R86.2 U7.11(RXD0/~{MODE0})
RXD1/MODE1: R64.2 R85.2 U7.10(RXD1/~{MODE1})
RXD2/RMIISEL: R63.2 R82.2 U7.9(RXD2/~{RMIISEL})
RXD3/PHYAD2: R62.2 R81.2 U7.8(RXD3/~{PHYAD2})
RXER/PHYAD0: R68.2 R80.2 U7.13(RXER/RXD4/~{PHYAD0})
SYS_RESETn: U7.19(nRST) ; off-sheet SYS_RESETn
NetC79_2: C79.2 U7.6(VDDCR)
NetC81_2: C81.2 C82.2 FB5.2 J1.3 J1.4
NetC83_2: C83.2 R74.1 R79.2 Y3.2
NetC84_2: C84.2 R79.1 U7.4(XTAL2) Y3.1
NetJ1_D1: J1.D1 R70.1
NetJ1_D3: J1.D3 R71.1
NetR66_2: R66.2 U7.26(RXDV)
NetR69_2: R69.2 U7.20(TXCLK)
NetR70_2: R70.2 U7.3(LED1/~{REGOFF})
NetR71_2: R71.2 U7.2(LED2/~{nINTSEL})
NetR73_2: R73.2 U7.14(CRS)
NetR74_2: R74.2 R75.2 U7.5(XTAL1/CLKIN)
NetR76_2: R76.2 U7.32(RBIAS)
NetR77_2: R77.2 U7.18(nINT/TXER/TXD4)

Not connected (* = marked no-connect by the designer): J1 7* M1* M2*

### Layout directives
net class ETHERNET: 3V3_ETH, 3V3_LDO, AM335X_MII1_MDIO_CLK, AM335X_MII1_MDIO_DATA, AM335X_MII1_RXCLK, AM335X_MII1_RXD0, AM335X_MII1_RXD1, AM335X_MII1_RXD2, AM335X_MII1_RXD3, AM335X_MII1_RXDV, AM335X_MII1_RXERR, AM335X_MII1_TXCLK, AM335X_MII1_TXD0, AM335X_MII1_TXD1, AM335X_MII1_TXD2, AM335X_MII1_TXD3, AM335X_MII1_TXEN, ETH_RXN, ETH_RXP, ETH_TXN, ETH_TXP, GND, MII1_COL, MII1_CRS_DV, MII1_REFCLK, MODE2, REFCLKO, RXD0/MODE0, RXD1/MODE1, RXD2/RMIISEL, RXD3/PHYAD2, RXER/PHYAD0, SYS_RESETn

### Notes on the sheet
- Embedded CPU Design
- ETHERNET
- 16
- 1.8
- 20
- 1.4
- (in symbol SDTitleBlock) Title:; Page Contents:; DWG NO; Revision:; Designer:; Date:; Sheet; of

### Library data of the parts
C76 C77 C80 = 0.1UF,6.3V,0805: as C44-C46 on sheet DDR_3; Supplier 1: Digi-Key; RoHS: RoHS Compliant; Category: Capacitors; Stock 1: 19204; Pricing 1: 1=0.12, 10=0.083, 25=0.062, 50=0.0476, 100=0.0392, 250=0.03304, 1000=0.02228 (USD); Packaging: Digi-Reel®; Tolerance: ±10%; Voltage - Rated: 6.3V; Temperature Coefficient: X7R; Mounting Type: Surface Mount, MLCC; Operating Temperature: -55°C ~ 125°C; Applications: General Purpose; Ratings: -; Package / Case: 0805 (2012 Metric); Size / Dimension: 0.079" L x 0.049" W (2.00mm x 1.25mm); Height - Seated (Max): -; Thickness (Max): 0.035" (0.88mm); Lead Spacing: -; Features: -; Lead Style: -; ComponentLink1URL: http://www.kemet.com/docfinder?Partnumber=C0805C104K9RACTU; ComponentLink1Description: http://www.kemet.com/docfinder?Partnumber=C0805C104K9RACTU; Supplier Part Number 1: 399-9155-6-ND
C78 = 10UF,10V,0805: Multilayer Ceramic Capacitors MLCC - SMD/SMT 10uF 10% 10Volts; Manufacturer: TDK; Manufacturer Part Number: C2012X7R1A106K125AC; Type: Multilayer Ceramic Chip Capacitor; Case Height: 1.25 mm; Case Length: 2 mm; Dielectric: X7R; Temperature Coefficient / Code: +/- 15 %; Supplier 1: Mouser; RoHS: RoHS Compliant; Category: Multilayer Ceramic Capacitors MLCC - SMD/SMT; Stock 1: 114858; Pricing 1: 1=0.609, 10=0.530, 100=0.195, 1000=0.171, 2000=0.126, 10000=0.116, 24000=0.111, 50000=0.104, 100000=0.097 (AUD); Capacitance: 10 uF; Operating Temperature Range: - 55 C to + 125 C; Package / Case: 0805 (2012 metric); Packaging: Reel; Product: General Type MLCCs; Termination Style: SMD/SMT; Tolerance: 10 %; Voltage Rating DC: 10 V; Brand: TDK; Case Code - in: 0805; Case Code - mm: 2012; Case Width: 1.25 mm; Maximum Operating Temperature: + 125 C; Minimum Operating Temperature: - 55 C; Standard Pack Qty: 2000; RoHS - Mouser: Y; Minimum Order Quantity: 1; Reeling: True; ComponentLink1URL: http://www.mouser.com/ds/2/400/mlcc_commercial_general_en-266370.pdf; ComponentLink1Description: http://www.mouser.com/ds/2/400/mlcc_commercial_general_en-266370.pdf; Supplier Part Number 1: 810-C2012X7R1A106K
C79 = 1UF,10V,0805: AVX - 0805ZC105JAT2A - CAP, MLCC, X7R, 1UF, 10V, 0805; Capacitance: 1; Capacitance Tolerance: ± 5%; Dielectric Characteristic: X7; Voltage Rating: 10; Ceramic Capacitor Case: 0805 [2012 Metric]; SVHC: No SVHC (16-Jun-2014); Capacitor Case Style: 0805 [2012 Metric]<!--FANDB--><div class="features-and-benefits-container"></div>; Tolerance: ±5%; Manufacturer: AVX; Manufacturer Part Number: 0805ZC105JAT2A; RoHS: YES; Product Range: -; Operating Temperature Min: -55; Operating Temperature Max: 125; Packaging: Cut Tape; MSL: MSL 1 - Unlimited; Capacitance Tolerance ±: ± 5%; ComponentLink1URL: http://www.farnell.com/datasheets/1679506.pdf; ComponentLink1Description: http://www.farnell.com/datasheets/1679506.pdf; Supplier 1: Digi-Key; Category: Capacitors; Stock 1: 13938; Pricing 1: 1=0.81, 10=0.689, 100=0.403, 250=0.338, 500=0.3055, 1000=0.2795 (USD); Voltage - Rated: 10V; Temperature Coefficient: X7R; Mounting Type: Surface Mount, MLCC; Operating Temperature: -55°C ~ 125°C; Applications: General Purpose; Ratings: -; Package / Case: 0805 (2012 Metric); Size / Dimension: 0.079" L x 0.049" W (2.01mm x 1.25mm); Height - Seated (Max): -; Thickness (Max): 0.055" (1.40mm); Lead Spacing: -; Features: -; Lead Style: -; ComponentLink2URL: http://www.avx.com/docs/Catalogs/cx7r.pdf; ComponentLink2Description: http://www.avx.com/docs/Catalogs/cx7r.pdf; Supplier Part Number 1: 478-6224-1-ND
C81 C82 = 0.1UF,16V,0805: as C86 on sheet CAN; Supplier 1: Digi-Key; Manufacturer: AVX; Manufacturer Part Number: 0805YC104KAT2A; RoHS: YES; Stock 1: 9101; Pricing 1: 1=0.29, 10=0.198, 100=0.1008, 250=0.0816, 500=0.072, 1000=0.0612 (USD); Product Range: -; Operating Temperature Min: -55; Operating Temperature Max: 125; Packaging: Cut Tape; MSL: MSL 1 - Unlimited; Capacitance Tolerance ±: ± 10%; ComponentLink1URL: http://www.farnell.com/datasheets/1679506.pdf; ComponentLink1Description: http://www.farnell.com/datasheets/1679506.pdf; Supplier Part Number 1: 478-7961-1-ND; Category: Capacitors; Voltage - Rated: 16V; Temperature Coefficient: X7R; Mounting Type: Surface Mount, MLCC; Operating Temperature: -55°C ~ 125°C; Applications: General Purpose; Ratings: -; Package / Case: 0805 (2012 Metric); Size / Dimension: 0.079" L x 0.049" W (2.00mm x 1.25mm); Height - Seated (Max): -; Thickness (Max): 0.037" (0.94mm); Lead Spacing: -; Features: -; Lead Style: -; ComponentLink2URL: http://www.avx.com/docs/Catalogs/cx7r.pdf; ComponentLink2Description: http://www.avx.com/docs/Catalogs/cx7r.pdf
C83 C84 = 18PF,50V,0805: MULTICOMP - MC0805N180J500CT - CAP, MLCC, C0G/NP0, 18PF, 50V,0805, REEL; Product Range: MULTICOMP - MC Series; Capacitance: 18; Capacitance Tolerance: ± 5%; Voltage Rating: 50; Ceramic Capacitor Case: 0805 [2012 Metric]; Capacitor Terminals: SMD; Reel Quantity: 4000; Tolerance: ±5%; Temperature Coefficient: C0G, NP0; Supplier 1: Digi-Key; Manufacturer: MULTICOMP; Manufacturer Part Number: MC0805N180J500CT; RoHS: YES; Pricing 1: 1=0.1, 10=0.048, 25=0.034, 50=0.026, 100=0.022, 250=0.018, 500=0.0154, 1000=0.012 (USD); Dielectric Characteristic: C0G / NP0; Operating Temperature Min: -55; Operating Temperature Max: 125; Packaging: Tape & Reel; MSL: -; Capacitance Tolerance ±: ± 5%; Capacitor Case Style: 0805 [2012 Metric]; ComponentLink1URL: http://www.farnell.com/datasheets/1792107.pdf; ComponentLink1Description: http://www.farnell.com/datasheets/1792107.pdf; Supplier Part Number 1: 709-1171-1-ND; Category: Capacitors; Stock 1: 33659; Voltage - Rated: 50V; Mounting Type: Surface Mount, MLCC; Operating Temperature: -55°C ~ 125°C; Applications: General Purpose; Ratings: -; Package / Case: 0805 (2012 Metric); Size / Dimension: 0.080" L x 0.050" W (2.03mm x 1.27mm); Height - Seated (Max): -; Thickness (Max): 0.050" (1.27mm); Lead Spacing: -; Features: -; Lead Style: -; ComponentLink2URL: http://www.johansondielectrics.com/images/stories/surface-mount/smt-mlc/JDI_Surface-Mount_2012-01.pdf; ComponentLink2Description: http://www.johansondielectrics.com/images/stories/surface-mount/smt-mlc/JDI_Surface-Mount_2012-01.pdf
FB4 = 150OHM,800MA: FERRITE 800MA 150 OHM 0805 SMD; Manufacturer: Laird-Signal Integrity Products; Manufacturer Part Number: LI0805H151R-10; Impedance @ Frequency: 150 Ohm @ 100MHz; DC Resistance (DCR): 150 mOhm Max; Filter Type: Differential Mode - Single; Supplier 1: Digi-Key; RoHS: RoHS Compliant; Category: Filters; Stock 1: 418596; Pricing 1: 1=0.1, 10=0.07, 25=0.064, 50=0.0574, 100=0.0421, 250=0.03064, 500=0.02808, 1000=0.02424 (USD); Packaging: Cut Tape (CT); Current Rating: 800mA; Package / Case: 0805 (2012 Metric); Mounting Type: Surface Mount; Height (Max): 0.043" (1.10mm); Size / Dimension: 0.079" L x 0.049" W (2.00mm x 1.25mm); ComponentLink1URL: http://www.lairdtech.com/WorkArea/linkit.aspx?LinkIdentifier=id&ItemID=4912; ComponentLink1Description: http://www.lairdtech.com/WorkArea/linkit.aspx?LinkIdentifier=id&ItemID=4912; Supplier Part Number 1: 240-2384-1-ND
FB5 = 600OHM,500MA: FERRITE CHIP 600 OHM 500MA 0603; Manufacturer: Murata Electronics North America; Manufacturer Part Number: BLM18AG601SN1D; Impedance @ Frequency: 600 Ohm @ 100MHz; DC Resistance (DCR): 380 mOhm Max; Filter Type: Differential Mode - Single; Supplier 1: Digi-Key; RoHS: RoHS Compliant; Category: Filters; Stock 1: 305151; Pricing 1: 1=0.1, 10=0.079, 50=0.0648, 100=0.0476, 250=0.0346, 500=0.0317, 1000=0.02738 (USD); Packaging: Digi-Reel®; Current Rating: 500mA; Package / Case: 0603 (1608 Metric); Mounting Type: Surface Mount; Height (Max): 0.037" (0.95mm); Size / Dimension: 0.063" L x 0.031" W (1.60mm x 0.80mm); ComponentLink1URL: http://search.murata.co.jp/Ceramy/image/img/PDF/ENG/L0110S0100BLM18A.pdf; ComponentLink1Description: http://search.murata.co.jp/Ceramy/image/img/PDF/ENG/L0110S0100BLM18A.pdf; Supplier Part Number 1: 490-1014-6-ND
J1 = ConnectorRJ45_10_100Mb: Connector MagRJ-45 Jack w/LED 10_100Mb; Mfr: Tyco; MfrNum: 5-6605728-1; TIIntPartnumber: 2J0020; Vendor: Digikey; Cost100: 8.45; Cost10K: 3.22; Descriptive_Text: Connector MagRJ-45 Jack w/LED 10_100Mb; PartName: ConnectorRJ45_10_100Mb; DescriptiveText: Connector MagRJ-45 Jack w/LED 10_100Mb; Supplier 1: Digi-Key; Supplier Part Number 1: 1419-1020-ND
R57-R60 = 49.9: PANASONIC - ERJP06F49R9V - RESISTOR, THICK FILM, 49.9 OHM, 0.5W, 1%; Product Range: PANASONIC - ERJ Series; Power Rating: 500; Resistor Case Style: 0805 [2012 Metric]; Temperature Coefficient: ± 100; Voltage Rating: 400; SVHC: No SVHC (16-Dec-2013; Power (Watts): 0.1W, 1/10W; Supplier 1: Digi-Key; Manufacturer: PANASONIC; Manufacturer Part Number: ERJP06F49R9V; RoHS: YES; Stock 1: 24718; Pricing 1: 1=0.63, 50=0.2494, 100=0.1924, 250=0.14964, 500=0.10546, 1000=0.07695 (USD); Resistance: 49.9; Resistance Tolerance: ± 1%; Resistor Element Material: Thick Film; Packaging: Cut Tape; MSL: -; ComponentLink1URL: http://www.farnell.com/datasheets/1801181.pdf; ComponentLink1Description: http://www.farnell.com/datasheets/1801181.pdf; ComponentLink2URL: http://www.farnell.com/datasheets/1718548.pdf; ComponentLink2Description: http://www.farnell.com/datasheets/1718548.pdf; Supplier Part Number 1: P49.9DACT-ND; Category: Resistors; Resistance (Ohms): 49.9; Tolerance: ±1%; Composition: Thick Film; Features: Automotive AEC-Q200; Operating Temperature: -55°C ~ 155°C; Package / Case: 0402 (1005 Metric); Supplier Device Package: 0402; Size / Dimension: 0.039" L x 0.020" W (1.00mm x 0.50mm); Height: 0.016" (0.40mm); Number of Terminations: 2; ComponentLink3URL: http://industrial.panasonic.com/www-cgi/jvcr13pz.cgi?E+PZ+3+AOA0002+ERJ2RKF49R9X+7+WW; ComponentLink3Description: http://industrial.panasonic.com/www-cgi/jvcr13pz.cgi?E+PZ+3+AOA0002+ERJ2RKF49R9X+7+WW; ComponentLink4URL: http://industrial.panasonic.com/www-cgi/jvcr13pz.cgi?E+PZ+3+AOA0026+ERA6AEB49R9V+7+WW; ComponentLink4Description: http://industrial.panasonic.com/www-cgi/jvcr13pz.cgi?E+PZ+3+AOA0026+ERA6AEB49R9V+7+WW
R61 R84-R86 = 1.5K,%1,0805: as R22 on sheet DDR_3; Manufacturer: MULTICOMP; Manufacturer Part Number: MCPWR05FTEW1501; RoHS: Y-EX; Resistance Tolerance: ± 1%; Packaging: Cut Tape; MSL: -; ComponentLink1URL: http://www.farnell.com/datasheets/1718729.pdf; ComponentLink1Description: http://www.farnell.com/datasheets/1718729.pdf; ComponentLink2URL: http://www.farnell.com/cad/1638340.zip; ComponentLink2Description: http://www.farnell.com/cad/1638340.zip; Supplier 1: Digi-Key; Category: Resistors; Stock 1: 277366; Pricing 1: 1=0.1, 50=0.0288, 100=0.0219, 250=0.01624, 500=0.012, 1000=0.008, 2500=0.00675 (USD); Resistance (Ohms): 1.5k; Tolerance: ±1%; Composition: Thick Film; Features: Automotive AEC-Q200; Operating Temperature: -55°C ~ 155°C; Package / Case: 0805 (2012 Metric); Supplier Device Package: 0805; Size / Dimension: 0.079" L x 0.049" W (2.00mm x 1.25mm); Height: 0.028" (0.70mm); Number of Terminations: 2; ComponentLink3URL: http://industrial.panasonic.com/www-cgi/jvcr13pz.cgi?E+PZ+3+AOA0002+ERJ6ENF1501V+7+WW; ComponentLink3Description: http://industrial.panasonic.com/www-cgi/jvcr13pz.cgi?E+PZ+3+AOA0002+ERJ6ENF1501V+7+WW; Supplier Part Number 1: P1.50KCCT-ND
R62-R69 R72 R73 = 100: RES 100 OHM 1/8W 1% 0805 SMD; Manufacturer: Rohm Semiconductor; Manufacturer Part Number: MCR10ERTF1000; Power (Watts): 0.125W, 1/8W; Temperature Coefficient: ±100ppm/°C; Supplier 1: Digi-Key; RoHS: RoHS Compliant; Category: Resistors; Stock 1: 27803; Pricing 1: 1=0.1, 10=0.027, 25=0.0196, 100=0.0109, 250=0.00832, 500=0.00666, 1000=0.0049 (USD); Packaging: Cut Tape (CT); Resistance (Ohms): 100; Tolerance: ±1%; Composition: Thick Film; Features: -; Package / Case: 0805 (2012 Metric); Supplier Device Package: 0805 (2012 Metric); Size / Dimension: 0.079" L x 0.049" W (2.00mm x 1.25mm); Height: 0.024" (0.60mm); Number of Terminations: 2; ComponentLink1URL: http://rohmfs.rohm.com/en/products/databook/datasheet/passive/resistor/chip_resistor/mcr_g.pdf; ComponentLink1Description: http://rohmfs.rohm.com/en/products/databook/datasheet/passive/resistor/chip_resistor/mcr_g.pdf; Supplier Part Number 1: RHM100CHCT-ND
R70 R71 = 150R,0805: TE CONNECTIVITY / NEOHM - CPF0805B150RE1 - RESISTOR, 0805, 150R; Product Range: TE CONNECTIVITY - CPF Series; Resistance: 150; Power Rating: 100; Resistance Tolerance: ± 0.1%; Resistor Case Style: 0805 [2012 Metric]; Resistor Element Material: Thin Film; Temperature Coefficient: ± 25; Voltage Rating: 200; External Depth: 0.5; External Length / Height: 2; External Width: 1.25; Resistor Mounting: SMD; Tolerance: ±5%; Power (Watts): 0.125W, 1/8W; Supplier 1: Digi-Key; Manufacturer: TE CONNECTIVITY / NEOHM; Manufacturer Part Number: CPF0805B150RE1; RoHS: YES; Stock 1: 143875; Pricing 1: 1=0.1, 10=0.021, 50=0.0116, 100=0.0088, 250=0.00652, 500=0.0048, 1000=0.0032, 2500=0.0027 (USD); Packaging: Cut Tape; MSL: -; No. of Pins: 2; Operating Temperature Max: 155; Operating Temperature Min: -55; Operating Temperature Range: -55°C to +155; Series: CPF<!--FANDB--><div class="features-and-benefits-container"></div>; ComponentLink1URL: http://www.tycoelectronics.com/commerce/DocumentDelivery/DDEController?Action=srchrtrv&DocNm=1614884&DocType=Customer+Drawing&DocLang=English; ComponentLink1Description: http://www.tycoelectronics.com/commerce/DocumentDelivery/DDEController?Action=srchrtrv&DocNm=1614884&DocType=Customer+Drawing&DocLang=English; ComponentLink2URL: http://www.tycoelectronics.com/commerce/DocumentDelivery/DDEController?Action=srchrtrv&DocNm=1773200&DocType=Data+Sheet&DocLang=English; ComponentLink2Description: http://www.tycoelectronics.com/commerce/DocumentDelivery/DDEController?Action=srchrtrv&DocNm=1773200&DocType=Data+Sheet&DocLang=English; Supplier Part Number 1: RMCF0805JT150RCT-ND; Category: Resistors; Resistance (Ohms): 150; Composition: Thick Film; Features: -; Operating Temperature: -55°C ~ 155°C; Package / Case: 0805 (2012 Metric); Supplier Device Package: 0805; Size / Dimension: 0.079" L x 0.049" W (2.00mm x 1.25mm); Height: 0.026" (0.65mm); Number of Terminations: 2; ComponentLink3URL: http://www.seielect.com/Catalog/SEI-RMCF_RMCP.pdf; ComponentLink3Description: http://www.seielect.com/Catalog/SEI-RMCF_RMCP.pdf
R74 R75 R78 = 0R,0805: BOURNS - CR0805-J/-000ELF - RESISTOR, 0805, 0R, 5%, 1/8W; Product Range: BOURNS - CR Series; Resistance: 0; Power Rating: 125; Resistor Case Style: 0805 [2012 Metric]; Resistor Element Material: Thick Film; Temperature Coefficient: -250ppm/°C to +500; Voltage Rating: 150; SVHC: No SVHC (16-Jun-2014); Resistor Mounting: SMD<!--FANDB--><div class="features-and-benefits-container"></div>; Connector Type: RJ45; Number of Ports: 1; LED Color: Green - Yellow; Number of Cores per Jack: 6; Shielding: Shielded, EMI Finger; Tab Direction: Up; Shield Material: Brass; Resistance (Ohms): 0.0; Tolerance: Jumper; Power (Watts): 0.125W, 1/8W; Supplier 1: Digi-Key; Manufacturer: BOURNS; Manufacturer Part Number: CR0805-J/-000ELF; RoHS: YES; Stock 1: 1539206; Pricing 1: 1=0.1, 50=0.0196, 100=0.0149, 250=0.01104, 500=0.00816, 1000=0.00544, 2500=0.00459 (USD); Resistance Tolerance: ± 5%; Packaging: Cut Tape; MSL: MSL 1 - Unlimited; ComponentLink1URL: http://www.farnell.com/datasheets/1845293.pdf; ComponentLink1Description: http://www.farnell.com/datasheets/1845293.pdf; Supplier Part Number 1: P0.0ACT-ND; Category: Connectors, Interconnects; Number of Rows: 1; Applications: 10/100 Base-T, AutoMDIX; Mounting Type: Through Hole; Orientation: 90° Angle (Right); Termination: Solder; Height Above Board: 0.555" (14.10mm); Features: Board Lock, Decoupling Capacitance; Contact Material: Phosphor Bronze; Contact Finish: Gold; Contact Finish Thickness: 50µin (1.27µm); Housing Material: Polyethylene Terephthalate (PET), Polyester; Operating Temperature: 0°C ~ 70°C; ComponentLink2URL: http://www.trpconnector.com/pdfs/6605728.pdf; ComponentLink2Description: http://www.trpconnector.com/pdfs/6605728.pdf; Composition: Thick Film; Package / Case: 0805 (2012 Metric); Supplier Device Package: 0805; Size / Dimension: 0.079" L x 0.049" W (2.00mm x 1.25mm); Height: 0.028" (0.70mm); Number of Terminations: 2; ComponentLink3URL: http://industrial.panasonic.com/www-cgi/jvcr13pz.cgi?E+PZ+3+AOA0001+ERJ6GEY0R00V+7+WW; ComponentLink3Description: http://industrial.panasonic.com/www-cgi/jvcr13pz.cgi?E+PZ+3+AOA0001+ERJ6GEY0R00V+7+WW
R76 R77 R80-R83 = 10K,0805: as R21 on sheet DDR_3; Manufacturer: BOURNS; Manufacturer Part Number: CR0805-FX-1002GLF; RoHS: YES; Resistance Tolerance: ± 1%; Packaging: Cut Tape; MSL: MSL 1 - Unlimited; ComponentLink1URL: http://www.farnell.com/datasheets/1845293.pdf; ComponentLink1Description: http://www.farnell.com/datasheets/1845293.pdf; Supplier 1: Digi-Key; Category: Resistors; Stock 1: 1116166; Pricing 1: 1=0.1, 10=0.029, 50=0.0162, 100=0.0123, 250=0.00912, 500=0.00672, 1000=0.00448, 2500=0.00378 (USD); Resistance (Ohms): 10k; Tolerance: ±1%; Composition: Thick Film; Features: -; Operating Temperature: -55°C ~ 155°C; Package / Case: 0805 (2012 Metric); Supplier Device Package: 0805; Size / Dimension: 0.079" L x 0.049" W (2.00mm x 1.25mm); Height: 0.026" (0.65mm); Number of Terminations: 2; ComponentLink2URL: http://www.seielect.com/Catalog/SEI-RMCF_RMCP.pdf; ComponentLink2Description: http://www.seielect.com/Catalog/SEI-RMCF_RMCP.pdf; Supplier Part Number 1: RMCF0805FT10K0CT-ND
R79 = 1M,0805: MULTICOMP - MC0805S8F1004T5E - RESISTOR, THICK FILM, 1MOHM, 125mW, 1%; Product Range: MULTICOMP - MC Series; Resistance: 1; Power Rating: 125; Resistor Case Style: 0805 ^2012 Metric]; Power (Watts): 0.125W, 1/8W; Temperature Coefficient: ±100ppm/°C; Supplier 1: Digi-Key; Manufacturer: MULTICOMP; Manufacturer Part Number: MC0805S8F1004T5E; RoHS: Y-EX; Stock 1: 548421; Pricing 1: 1=0.1, 50=0.0288, 100=0.0219, 250=0.01624, 500=0.012, 1000=0.008, 2500=0.00675 (USD); Resistance Tolerance: ± 1%; Resistor Element Type: Thick Film; MSL: -; ComponentLink1URL: http://www.newark.com/pdfs/datasheets/spc/TA-677.pdf; ComponentLink1Description: http://www.newark.com/pdfs/datasheets/spc/TA-677.pdf; Supplier Part Number 1: P1.00MCCT-ND; Category: Resistors; Packaging: Cut Tape (CT); Resistance (Ohms): 1M; Tolerance: ±1%; Composition: Thick Film; Features: Automotive AEC-Q200; Operating Temperature: -55°C ~ 155°C; Package / Case: 0805 (2012 Metric); Supplier Device Package: 0805; Size / Dimension: 0.079" L x 0.049" W (2.00mm x 1.25mm); Height: 0.028" (0.70mm); Number of Terminations: 2; ComponentLink2URL: http://industrial.panasonic.com/www-cgi/jvcr13pz.cgi?E+PZ+3+AOA0002+ERJ6ENF1004V+7+WW; ComponentLink2Description: http://industrial.panasonic.com/www-cgi/jvcr13pz.cgi?E+PZ+3+AOA0002+ERJ6ENF1004V+7+WW
U7 = LAN8710A-QFN-32: Manufacturer: Microchip Technology; Manufacturer Part Number: LAN8710AI-EZK; Ethernet Connection Type: 10/100 Base-T; Standard Supported: 802.3, 802.3u; Supply Voltage - Max: 3.6 V; Supply Voltage - Min: 1.6 V; Supplier 1: Mouser; RoHS: RoHS Compliant; Category: Ethernet ICs; Stock 1: 10327; Pricing 1: 1=2.35, 10=2.03, 25=1.69, 100=1.54 (AUD); Package / Case: QFN-32; Packaging: Tray; Product: Ethernet Transceivers; Type: Single Chip PHY Transceiver; Brand: Microchip Technology; Mounting Style: SMD/SMT; Maximum Operating Temperature: + 85 C; Minimum Operating Temperature: - 40 C; Product Category: Ethernet Controllers; Standard Pack Qty: 490; RoHS - Mouser: Y; Minimum Order Quantity: 1; Reeling: False; ComponentLink1URL: http://www.mouser.com/ds/2/268/8710a-320908.pdf; ComponentLink1Description: http://www.mouser.com/ds/2/268/8710a-320908.pdf; Supplier Part Number 1: 886-LAN8710AI-EZK
Y3 = Crystal25MHzABM3: Crystal 25MHz; TIIntPartnumber: 1Y0030; MfrNum: ABM3-25.000MHz-B2-T; Mfr: Abracon; Manufacturer: Abracon Corporation; Cost10K: 0.51; Cost100: 0.90; Vendor: Digikey; TN: tbd; Frequency Stability: ±50ppm; Frequency Tolerance: ±20ppm; Load Capacitance: 18pF; ESR (Equivalent Series Resistance): 30 Ohm; Operating Mode: Fundamental; Descriptive_Text: Crystal 25MHz; PartName: Crystal25MHzABM3; DescriptiveText: Crystal 25MHz; Supplier 1: Digi-Key; Supplier Part Number 1: 535-9108-1-ND; Manufacturer Part Number: ABM3-25.000MHZ-B2-T; RoHS: RoHS Compliant; Category: Crystals and Oscillators; Stock 1: 10200; Pricing 1: 1=1.04, 10=0.92, 50=0.8588, 100=0.76, 500=0.7182 (USD); Packaging: Cut Tape (CT); Type: MHz Crystal; Frequency: 25MHz; Operating Temperature: -20°C ~ 70°C; Ratings: -; Mounting Type: Surface Mount; Package / Case: 2-SMD; Size / Dimension: 0.197" L x 0.126" W (5.00mm x 3.20mm); Height: 0.051" (1.30mm); ComponentLink1URL: http://www.abracon.com/Resonators/abm3.pdf; ComponentLink1Description: http://www.abracon.com/Resonators/abm3.pdf

## Sheet ID_MEMORY.SchDoc
size A2
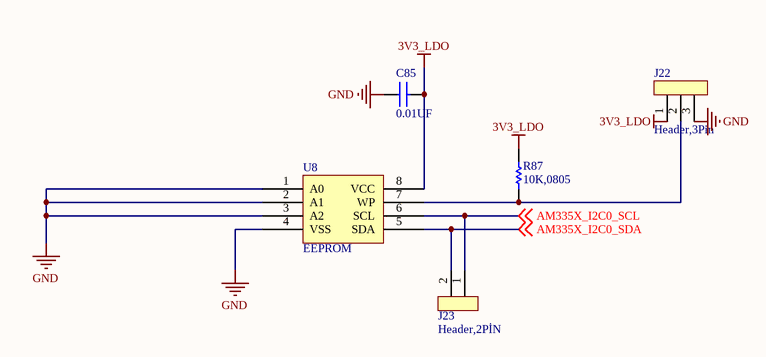
[diagram p13: ID_MEMORY.SchDoc]

### Parts
C85  0.01UF  [0805]
J22  Header,3Pin  [HEADER,3PİN]
J23  Header,2PİN  [HEADER,2PİN]
R87  10K,0805  [0805]
U8  EEPROM  [SOIC-8]

### Nets
3V3_LDO: C85.2 J22.1 R87.2 U8.8(VCC)
GND: C85.1 J22.3 U8.1(A0) U8.2(A1) U8.3(A2) U8.4(VSS)
AM335X_I2C0_SCL: J23.1 U8.6(SCL) ; off-sheet AM335X_I2C0_SCL
AM335X_I2C0_SDA: J23.2 U8.5(SDA) ; off-sheet AM335X_I2C0_SDA
NetJ22_2: J22.2 R87.1 U8.7(WP)

### Library data of the parts
C85 = 0.01UF: MULTICOMP - MCSH21B103K100CT - CAP, MLCC, X7R, 10NF, 10V, 0805; Capacitance: 10000pF; Tolerance: ±10%; Voltage - Rated: 16V; Manufacturer: MULTICOMP; Manufacturer Part Number: MCSH21B103K100CT; RoHS: YES; ComponentLink1URL: http://www.farnell.com/datasheets/1825494.pdf; ComponentLink1Description: http://www.farnell.com/datasheets/1825494.pdf; Category: Capacitors; Packaging: Cut Tape (CT); Temperature Coefficient: X7R; Mounting Type: Surface Mount, MLCC; Operating Temperature: -55°C ~ 125°C; Applications: General Purpose; Ratings: -; Package / Case: 0805 (2012 Metric); Size / Dimension: 0.079" L x 0.049" W (2.00mm x 1.25mm); Height - Seated (Max): -; Thickness (Max): 0.035" (0.88mm); Lead Spacing: -; Features: -; Lead Style: -; ComponentLink2URL: http://www.kemet.com/docfinder?Partnumber=C0805C103K4RACTU; ComponentLink2Description: http://www.kemet.com/docfinder?Partnumber=C0805C103K4RACTU; Supplier 1: Digi-Key; Stock 1: 3115623; Pricing 1: 1=0.1, 10=0.012, 50=0.0066, 100=0.0057, 250=0.00464, 500=0.00396, 1000=0.00309, 5000=0.00258 (USD); ComponentLink3URL: http://www.murata.com/~/media/webrenewal/support/library/catalog/products/capacitor/mlcc/c02e.ashx; ComponentLink3Description: http://www.murata.com/~/media/webrenewal/support/library/catalog/products/capacitor/mlcc/c02e.ashx; Supplier Part Number 1: 490-1313-1-ND
R87 = 10K,0805: as R21 on sheet DDR_3; Manufacturer: BOURNS; Manufacturer Part Number: CR0805-FX-1002GLF; RoHS: YES; Resistance Tolerance: ± 1%; Packaging: Cut Tape; MSL: MSL 1 - Unlimited; ComponentLink1URL: http://www.farnell.com/datasheets/1845293.pdf; ComponentLink1Description: http://www.farnell.com/datasheets/1845293.pdf; Supplier 1: Digi-Key; Category: Resistors; Stock 1: 1116166; Pricing 1: 1=0.1, 10=0.029, 50=0.0162, 100=0.0123, 250=0.00912, 500=0.00672, 1000=0.00448, 2500=0.00378 (USD); Resistance (Ohms): 10k; Tolerance: ±1%; Composition: Thick Film; Features: -; Operating Temperature: -55°C ~ 155°C; Package / Case: 0805 (2012 Metric); Supplier Device Package: 0805; Size / Dimension: 0.079" L x 0.049" W (2.00mm x 1.25mm); Height: 0.026" (0.65mm); Number of Terminations: 2; ComponentLink2URL: http://www.seielect.com/Catalog/SEI-RMCF_RMCP.pdf; ComponentLink2Description: http://www.seielect.com/Catalog/SEI-RMCF_RMCP.pdf; Supplier Part Number 1: RMCF0805FT10K0CT-ND
U8 = EEPROM: Manufacturer: ON Semiconductor; Manufacturer Part Number: CAT24C256WI-GT3; Format - Memory: EEPROMs - Serial; Memory Size: 256K (32K x 8); Speed: 400kHz; Interface: I²C, 2-Wire Serial; Voltage - Supply: 1.8 V ~ 5.5 V; Supplier 1: Digi-Key; RoHS: RoHS Compliant; Category: Integrated Circuits (ICs); Stock 1: 33600; Pricing 1: 1=0.73, 10=0.616, 25=0.5396, 100=0.462, 250=0.40068, 500=0.33936, 1000=0.26163 (USD); Packaging: Cut Tape (CT); Memory Type: EEPROM; Operating Temperature: -40°C ~ 85°C; Package / Case: 8-SOIC (0.154", 3.90mm Width); Supplier Device Package: 8-SOIC; ComponentLink1URL: http://www.onsemi.com/pub_link/Collateral/CAT24C256-D.PDF; ComponentLink1Description: http://www.onsemi.com/pub_link/Collateral/CAT24C256-D.PDF; Supplier Part Number 1: CAT24C256WI-GT3OSCT-ND